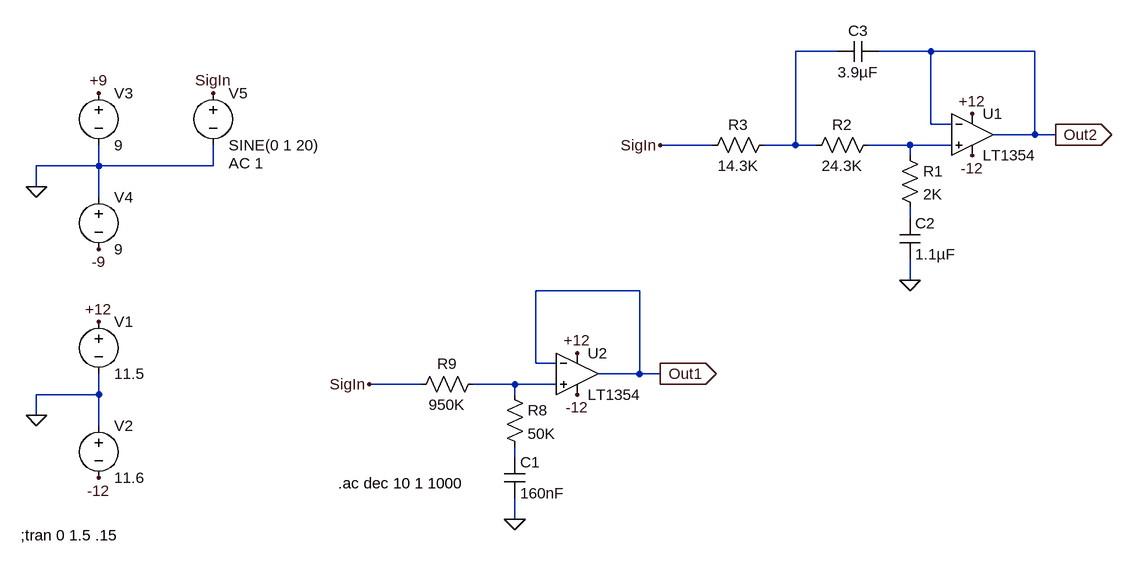
[diagram p0: schematic pll_loop_filt_active.asc]
pll_loop_filt_active.asc, the LTspice schematic file:
Version 4
SHEET 1 2008 1044
WIRE 832 48 768 48
WIRE 976 48 896 48
WIRE 1136 48 976 48
WIRE 976 160 976 48
WIRE 1008 160 976 160
WIRE 1136 176 1136 48
WIRE 1136 176 1072 176
WIRE 1168 176 1136 176
WIRE 640 192 560 192
WIRE 768 192 768 48
WIRE 768 192 720 192
WIRE 800 192 768 192
WIRE 944 192 880 192
WIRE 1008 192 944 192
WIRE 944 208 944 192
WIRE -304 224 -304 192
WIRE -304 224 -400 224
WIRE -128 224 -128 192
WIRE -128 224 -304 224
WIRE -400 256 -400 224
WIRE -304 272 -304 224
WIRE 944 304 944 288
WIRE 944 400 944 368
WIRE 528 416 368 416
WIRE 368 528 368 416
WIRE 400 528 368 528
WIRE 528 544 528 416
WIRE 528 544 464 544
WIRE 560 544 528 544
WIRE 192 560 112 560
WIRE 336 560 272 560
WIRE 400 560 336 560
WIRE -304 576 -304 544
WIRE -304 576 -400 576
WIRE 336 576 336 560
WIRE -400 608 -400 576
WIRE -304 624 -304 576
WIRE 336 672 336 656
WIRE 336 768 336 736
FLAG -400 608 0
FLAG -304 464 +12
FLAG -304 704 -12
FLAG -400 256 0
FLAG -304 112 +9
FLAG -304 352 -9
FLAG -128 112 SigIn
FLAG 432 512 +12
FLAG 432 576 -12
FLAG 336 768 0
FLAG 112 560 SigIn
FLAG 560 544 Out1
IOPIN 560 544 Out
FLAG 1040 144 +12
FLAG 1040 208 -12
FLAG 944 400 0
FLAG 560 192 SigIn
FLAG 1168 176 Out2
IOPIN 1168 176 Out
SYMBOL voltage -304 448 R0
WINDOW 123 0 0 Left 0
WINDOW 39 0 0 Left 0
SYMATTR InstName V1
SYMATTR Value 11.5
SYMBOL voltage -304 608 R0
WINDOW 123 0 0 Left 0
WINDOW 39 0 0 Left 0
SYMATTR InstName V2
SYMATTR Value 11.6
SYMBOL voltage -304 96 R0
WINDOW 123 0 0 Left 0
WINDOW 39 0 0 Left 0
SYMATTR InstName V3
SYMATTR Value 9
SYMBOL voltage -304 256 R0
WINDOW 123 0 0 Left 0
WINDOW 39 0 0 Left 0
SYMATTR InstName V4
SYMATTR Value 9
SYMBOL voltage -128 96 R0
WINDOW 123 24 124 Left 2
WINDOW 39 0 0 Left 0
SYMATTR Value2 AC 1
SYMATTR InstName V5
SYMATTR Value SINE(0 1 20)
SYMBOL OpAmps\\LT1354 432 480 R0
SYMATTR InstName U2
SYMBOL res 320 560 R0
SYMATTR InstName R8
SYMATTR Value 50K
SYMBOL res 176 576 R270
WINDOW 0 32 56 VTop 2
WINDOW 3 0 56 VBottom 2
SYMATTR InstName R9
SYMATTR Value 950K
SYMBOL cap 320 672 R0
SYMATTR InstName C1
SYMATTR Value 160nF
SYMBOL OpAmps\\LT1354 1040 112 R0
SYMATTR InstName U1
SYMBOL res 928 192 R0
SYMATTR InstName R1
SYMATTR Value 2K
SYMBOL res 784 208 R270
WINDOW 0 32 56 VTop 2
WINDOW 3 0 56 VBottom 2
SYMATTR InstName R2
SYMATTR Value 24.3K
SYMBOL cap 928 304 R0
SYMATTR InstName C2
SYMATTR Value 1.1µF
SYMBOL res 624 208 R270
WINDOW 0 32 56 VTop 2
WINDOW 3 0 56 VBottom 2
SYMATTR InstName R3
SYMATTR Value 14.3K
SYMBOL cap 896 32 R90
WINDOW 0 0 32 VBottom 2
WINDOW 3 32 32 VTop 2
SYMATTR InstName C3
SYMATTR Value 3.9µF
TEXT -424 792 Left 2 !;tran 0 1.5 .15
TEXT 64 712 Left 2 !.ac dec 10 1 1000

The netlist it stands for:
* pll_loop_filt_active.asc
V1 +12 0 11.5
V2 0 -12 11.6
V3 +9 0 9
V4 0 -9 9
V5 SigIn 0 SINE(0 1 20) AC 1
XU2 N004 Out1 +12 -12 Out1 LT1354  ; pins In+ In- V+ V- OUT
R8 N004 N005 50K
R9 SigIn N004 950K
C1 N005 0 160nF
XU1 N002 Out2 +12 -12 Out2 LT1354  ; pins In+ In- V+ V- OUT
R1 N002 N003 2K
R2 N001 N002 24.3K
C2 N003 0 1.1µF
R3 SigIn N001 14.3K
C3 Out2 N001 3.9µF
;tran 0 1.5 .15
.ac dec 10 1 1000
.backanno
.end